# EAGLE design rectifier (EAGLE 9.6.2)
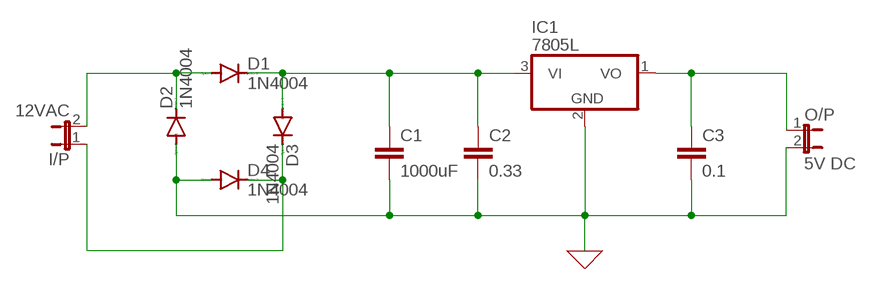
[diagram p0: schematic, sheet 1]

## Parts
C1  1000uF  C2,5-3  [C2.5-3]
C2  0.33  C2,5-3  [C2.5-3]
C3  0.1  C2,5-3  [C2.5-3]
D1  1N4004  [DO41-10]
D2  1N4004  [DO41-10]
D3  1N4004  [DO41-10]
D4  1N4004  [DO41-10]
I/P  12VAC  JP1E  [JP1]
IC1  7805L  [TO92]
O/P  5V DC  JP1E  [JP1]

## Nets
0: C1.2 C2.2 C3.2 D2.A D4.A IC1.2(GND) O/P.2 ; supply symbol labelled GND
N$1: D1.A D2.C I/P.2
N$2: C3.1 IC1.1(VO) O/P.1
N$4: D3.C D4.C I/P.1
N$5: C1.1 C2.1 D1.C D3.A IC1.3(VI)

## Library data of the parts
C1-C3 = capacitor-wima:C: CAPACITOR naming: grid - package width
D1-D4 = diode:1N4004: DIODE general purpose rectifier, 1 A
I/P O/P = jumper:JP1E: JUMPER
IC1 = linear:78*: Positive VOLTAGE REGULATOR Source: http://cache.national.com/ds/LM/LM78L05.pdf http://www.fairchildsemi.com/ds/LM/LM7805.pdf

## Board
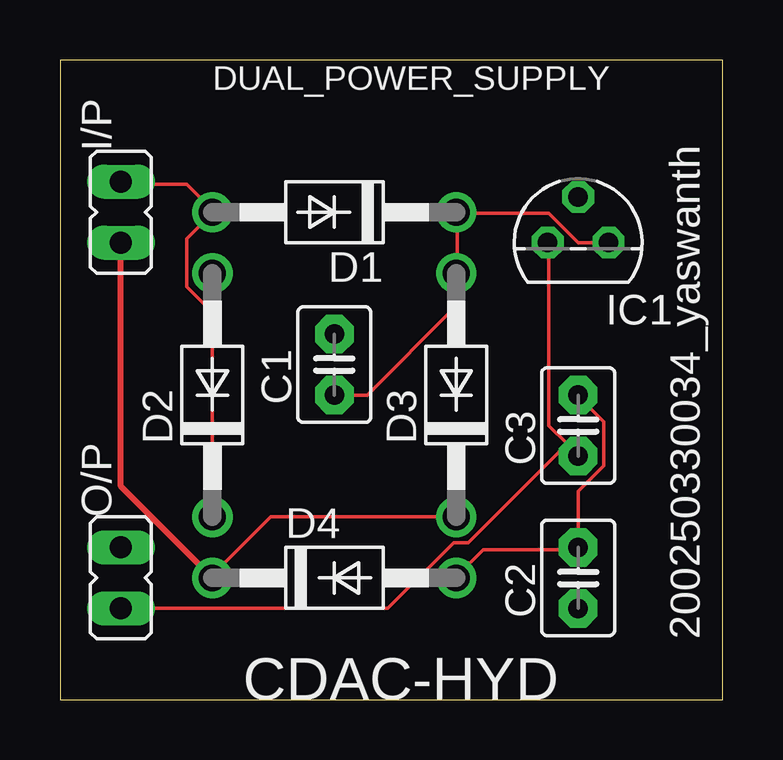
[diagram p1: board, top side]
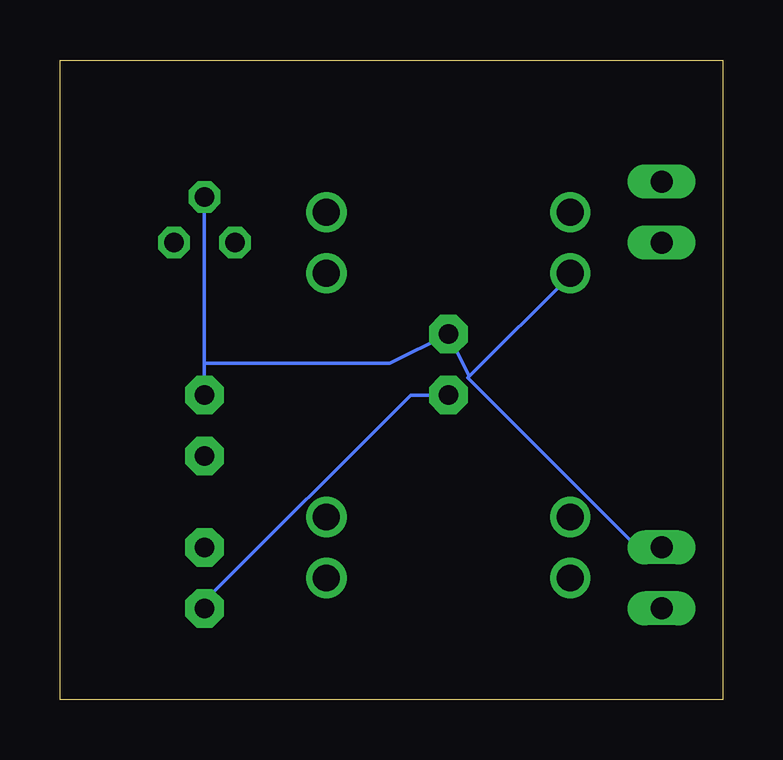
[diagram p2: board, bottom side, seen from below]

Size 27.61 x 26.66 mm. Coordinates in mm from the lower left corner, seen from the top.
Outline: 0,0 27.61,0 27.61,26.66 0,26.66 0,0
Copper layers (1*16): Top 0.035mm / dielectric 1.5mm / Bottom 0.035mm
Design rules "default": minimum track width 6mil, minimum drill 0.35mm, track to track 6mil, track to pad 6mil, pad to pad 6mil, via to via 6mil, smd to smd 6mil, copper to edge 40mil, drill to drill 6mil, minimum pad ring 10mil, minimum via ring 8mil, stop-mask expansion 4mil, vias tented up to drill 0mil, thermal gap 10mil

### Footprints (pad centres in the part's own frame; a part is rotated, then mirrored left to right if it is on the bottom)
C2.5-3 = drill 0.813 pad 1.6 octagon: 1 -1.27,0; 2 1.27,0
DO41-10 = drill 1.118: A 5.08,0; C -5.08,0
JP1 = drill 0.914 long: 1 0,-1.27; 2 0,1.27
TO92 = drill 0.813 octagon: 1 -1.27,0; 2 0,1.905; 3 1.27,0

### Placement (x,y rotation side)
C1  11.43,13.97 90 top
C2  21.59,5.08 90 top
C3  21.59,11.43 90 top
D1  11.43,20.32 180 top
D2  6.35,12.7 90 top
D3  16.51,12.7 90 top
D4  11.43,5.08 0 top
I/P  2.54,20.32 0 top
IC1  21.59,19.05 0 top
O/P  2.54,5.08 0 top

### Tracks (layer width: path | path; a pad name or v marks a point on that pad's centre or on a via)
0
  Top 0.152: D4.A 16.56,5.18 17.63,6.25 21.59,6.25 C2.2 21.59,8.69 22.66,9.75 22.66,11.58 21.59,12.65 C3.2
  Bottom 0.152: O/P.2 2.54,6.4 3.61,6.4 10.62,13.41 10.55,13.48 | 10.55,13.48 C1.2 13.87,14.02 21.59,14.02 | 10.55,13.48 6.35,17.68 D2.A | C3.2 21.59,14.02 | 21.59,14.02 IC1.2
N$1
  Top 0.152: I/P.2 2.54,21.49 5.28,21.49 6.35,20.42 D1.A 6.35,20.27 5.28,19.2 5.28,17.22 6.35,16.15 D2.C
N$2
  Top 0.152: 21.13,10.67 21.59,10.21 C3.1 21.13,10.67 | 21.13,10.67 20.37,11.43 20.37,19.05 IC1.1 | O/P.1 13.67,3.81 16.41,6.55 17.02,6.55 21.13,10.67
N$4
  Top 0.152: D3.C 8.79,7.62 6.35,5.18 D4.C
  Top 0.254: D4.C 2.54,8.89 I/P.1
N$5
  Top 0.152: IC1.3 21.59,19.05 20.37,20.27 16.56,20.27 | 16.56,20.27 16.56,17.83 D3.A 16.41,17.68 16.41,16.31 12.8,12.7 C1.1 | 16.56,20.27 D1.C
  Bottom 0.152: C2.1 21.59,4.12 13.01,12.7 C1.1

### Text on the board
tPlace: CDAC-HYD
tNames: DUAL_POWER_SUPPLY | 200250330034_yaswanth